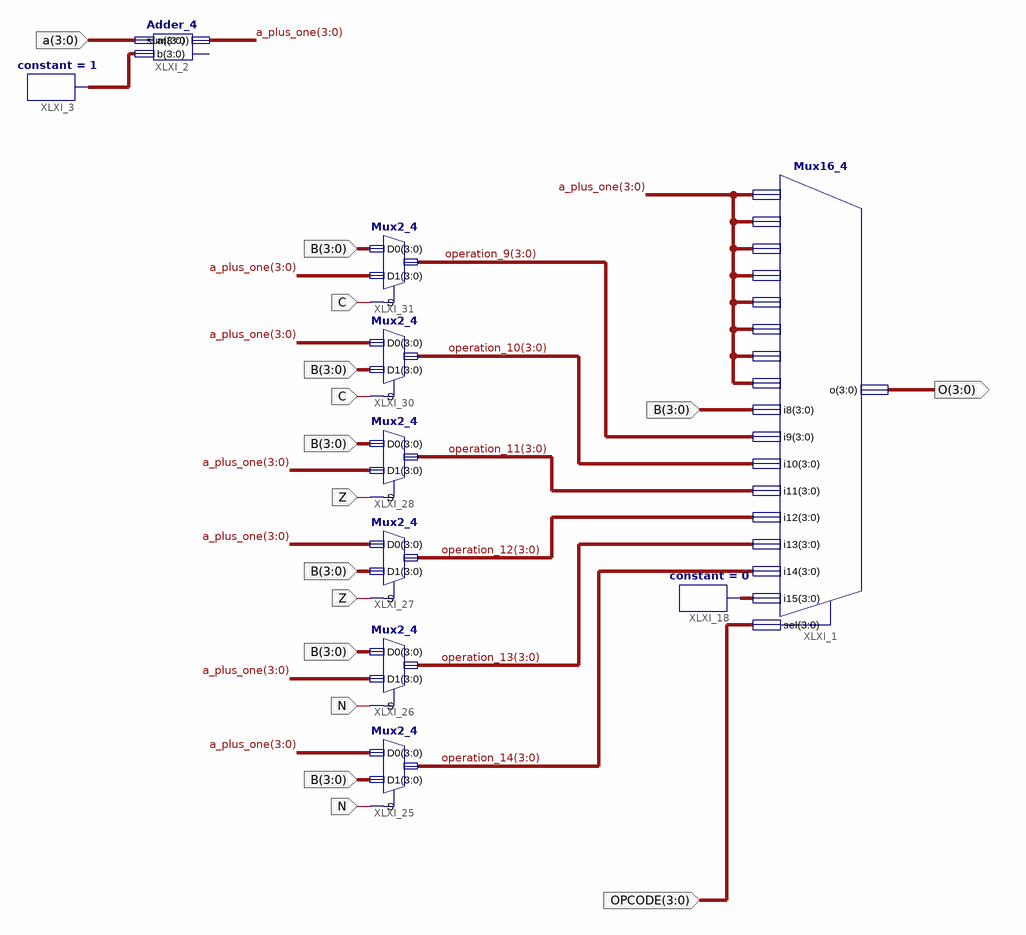
[diagram p0: schematic sheet 1]
// Xilinx ISE schematic ControlALU.sch (spartan3e) as structural Verilog: 10 symbols, 7 ports
module ControlALU (
  input  [3:0] a,
  input  [3:0] B,
  input  [3:0] OPCODE,
  input  C,
  input  Z,
  input  N,
  output [3:0] O
);

  wire [3:0] a_plus_one, operation_9, operation_10, operation_11, operation_12, operation_13, operation_14,
       XLXN_5, XLXN_35;

  Mux16_4 XLXI_1 (
    .i0(a_plus_one), .i1(a_plus_one), .i2(a_plus_one), .i3(a_plus_one), .i4(a_plus_one), .i5(a_plus_one),
    .i6(a_plus_one), .i7(a_plus_one), .i8(B), .i9(operation_9), .i10(operation_10), .i11(operation_11),
    .i12(operation_12), .i13(operation_13), .i14(operation_14), .i15(XLXN_35), .sel(OPCODE), .o(O));
  constant #(.CValue("0")) XLXI_18 (.O(XLXN_35));
  Mux2_4 XLXI_25 (.O(operation_14), .D0(a_plus_one), .D1(B), .S(N));
  Mux2_4 XLXI_26 (.O(operation_13), .D0(B), .D1(a_plus_one), .S(N));
  Mux2_4 XLXI_27 (.O(operation_12), .D0(a_plus_one), .D1(B), .S(Z));
  Mux2_4 XLXI_28 (.O(operation_11), .D0(B), .D1(a_plus_one), .S(Z));
  Mux2_4 XLXI_30 (.O(operation_10), .D0(a_plus_one), .D1(B), .S(C));
  Mux2_4 XLXI_31 (.O(operation_9), .D0(B), .D1(a_plus_one), .S(C));
  Adder_4 XLXI_2 (.a(a), .b(XLXN_5), .sum(a_plus_one));  // open: carry
  constant #(.CValue("1")) XLXI_3 (.O(XLXN_5));
endmodule
